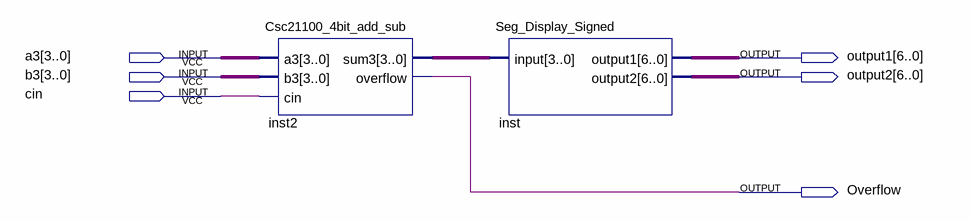
[diagram p0: schematic sheet]
// Quartus schematic BlockDisplay.bdf as structural Verilog: 2 symbols, 6 pins
module BlockDisplay (
  input  [3:0] a3,
  input  [3:0] b3,
  input  cin,
  output [6:0] output1,
  output [6:0] output2,
  output Overflow
);

  wire [3:0] inst2_sum3;

  Csc21100_4bit_add_sub inst2 (.a3(a3), .b3(b3), .cin(cin), .sum3(inst2_sum3), .overflow(Overflow));
  Seg_Display_Signed inst (.\input (inst2_sum3), .output1(output1), .output2(output2));
endmodule
